# Altium schematic sheet PDC_Low_Current_Outputs.SchDoc
size A
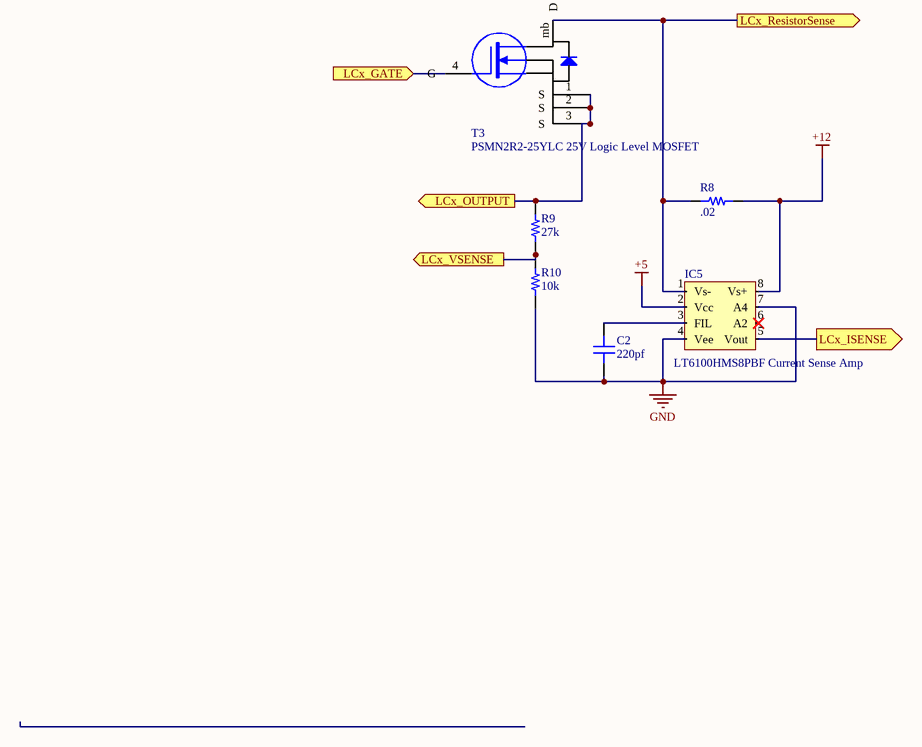
[diagram p0: PDC_Low_Current_Outputs.SchDoc]

## Parts
C2  value 220pf  [CAP 0402/1005]  (hidden comment: Capacitor MLCC 220pf 16V CAP 0402/1005)
IC5  LT6100HMS8PBF Current Sense Amp  [MSOP-8]
R8  value .02  [RES 2010/5025]  (hidden comment: Resistor .02 2010 1W 1%)
R9  value 27k  [RES 0805/2012]  (hidden comment: Resistor 27k 0805 1/10W 10%)
R10  value 10k  [RES 0402/1005]  (hidden comment: Resistor 10k 0402 1/10W 1%)
T3  PSMN2R2-25YLC 25V Logic Level MOSFET  [LFPAK-SO8]

## Ports
LCx_GATE (in), LCx_ISENSE (out), LCx_OUTPUT (out), LCx_ResistorSense (out), LCx_VSENSE (out)

## Nets
+5: IC5.2(Vcc)
+12: IC5.8(Vs+) R8.2
GND: C2.1 IC5.4(Vee) IC5.7(A4) R10.1
LCx_GATE: T3.4(G) ; port LCx_GATE
LCx_ISENSE: IC5.5(Vout) ; port LCx_ISENSE
LCx_OUTPUT: R9.2 T3.1(S) T3.2(S) T3.3(S) ; port LCx_OUTPUT
LCx_ResistorSense: IC5.1(Vs-) R8.1 T3.mb(D) ; port LCx_ResistorSense
LCx_VSENSE: R9.1 R10.2 ; port LCx_VSENSE
NetC2_2: C2.2 IC5.3(FIL)

Not connected (* = marked no-connect by the designer): IC5 6(A2)*

## Library data of the parts
C2 = 57: Manufacturer_id: 1; idCapacitor: 57; Name: Cap_220pf_16V_CAP 0402/1005; Dielectric: Ceramic; Created_By: Nick Mah; Drawer_id: 1; Voltage_Rating: 16V; Package: CAP 0402/1005; Created_Date: 10/20/2018
IC5 = 13: Manufacturer_id: 1; idIC_Misc: 13; Name: LT6100 Current Sense Amp; Created_By: Eddy; Drawer_id: 1; Package: MS8; Created_Date: 10/17/2018
R8 = 2701: Current Sense Resistor; Manufacturer_id: 1; MfrPartNo: CSRN2010FK20L0; idResistor: 2701; Name: Res_.02_2010_1W_1%; Created_By: Angel; Supplier 1: Digi-Key; Supplier Part Number 1: Digi-Key; Drawer_id: 1; Tolerance: 1%; Power: 1W; Package: 2010; Link: https://www.digikey.com/product-detail/en/stackpole-electronics-inc/CSRN2010FK20L0/CSRN2010FK20L0TR-ND/1646098; ComponentLink1Description: Datasheet
R9 = 2430: Manufacturer_id: 1; idResistor: 2430; Name: Res_27k_0805_1/10W_10%; Created_By: Nick Mah; Supplier 1: Digi-Key; Drawer_id: 1; Tolerance: 10%; Power: 1/10W; Package: 0805; ComponentLink1Description: Datasheet; Created_Date: 2018-10-20
R10 = 97: Manufacturer_id: 1; idResistor: 97; Name: Res_10k_0402_1/10W_1%; Created_By: Nick Mah; Supplier 1: Digi-Key; Drawer_id: 1; Tolerance: 1%; Power: 1/10W; Package: 0402; ComponentLink1Description: Datasheet; Created_Date: 2018-10-20
T3 = 3: N-Channel 25V 100A (Tc) 106W (Tc) Surface Mount LFPAK56, Power-SO8; Manufacturer_id: 6; MfrPartNo: PSMN2R2-25YLC,115; idFETs: 3; Drawer_id: 1; Value: N_Channel; Rds_On: 2.5mOhm; Vgs(typ): 10V; Vgs(Max): 20V; Created_By: Nick; Name: PSMN2R2; Vdss: 25V; Num_Circuits: 1; Id: 100A; Package: LFPAK-SO8; Link: https://www.digikey.com/product-detail/en/nexperia-usa-inc/PSMN2R2-25YLC115/1727-5299-1-ND/2674299; ComponentLink1Description: Datasheet; ComponentLink1URL: https://assets.nexperia.com/documents/data-sheet/PSMN2R2-25YLC.pdf; Supplier1: Digi-Key; Supplier1PartNo: 1727-5299-1-ND